# Altium project tester_board.PrjPCB (part 1 of 4)
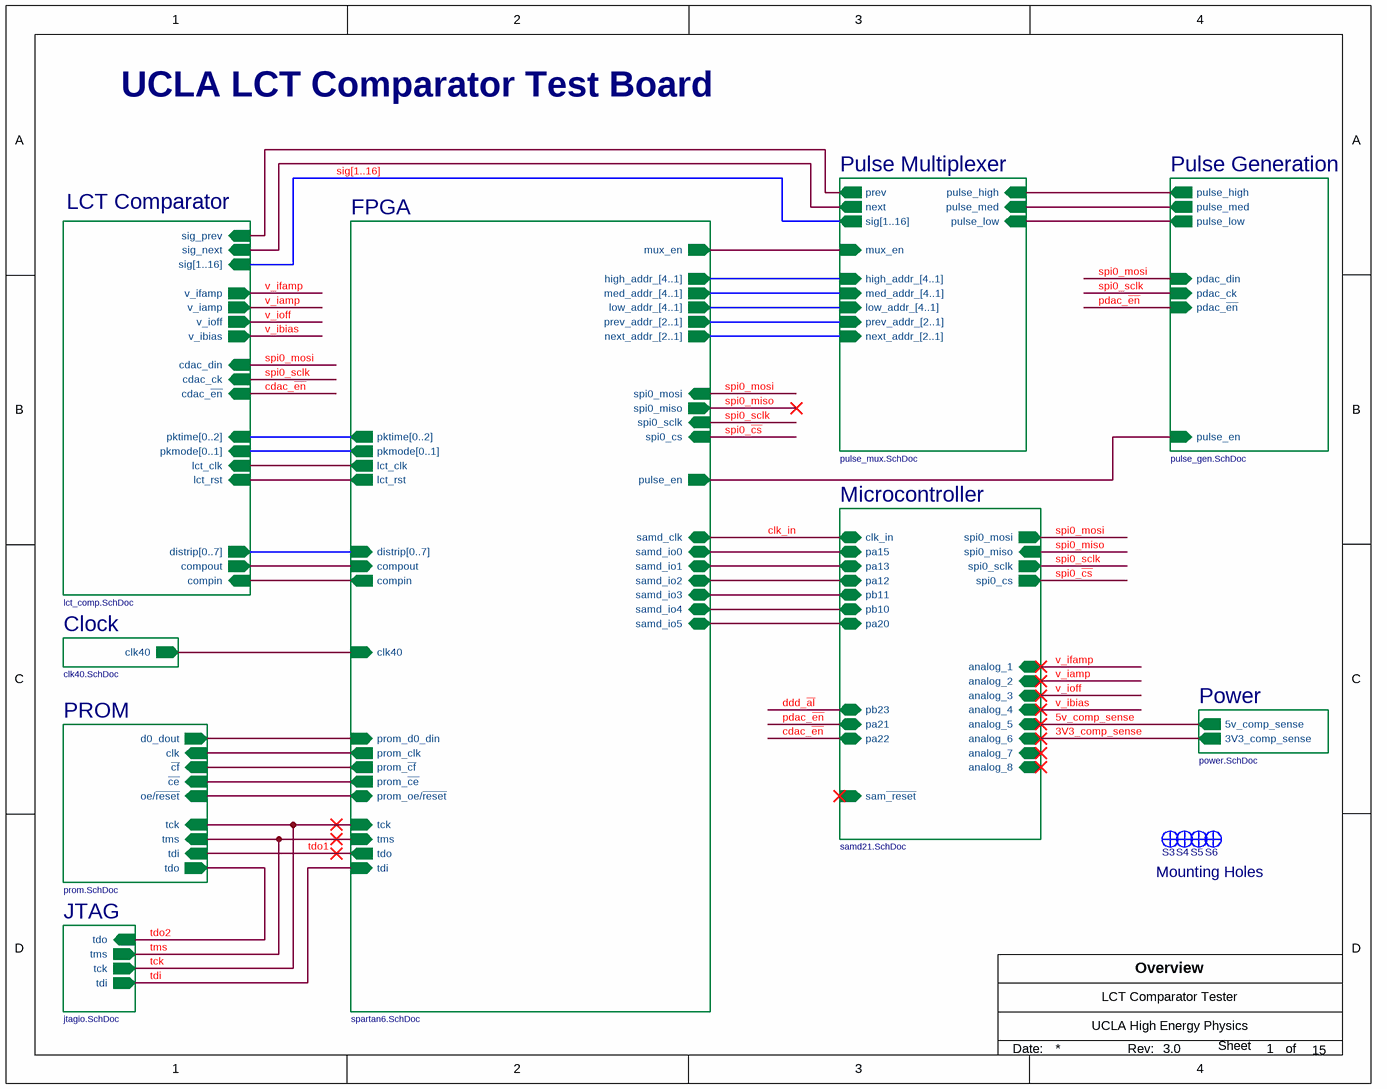
[diagram p0: tester_board.SchDoc]
15 sheets, 418 parts. Net scope: hierarchical (ports join the sheet entries above them; power ports are global).
Board file: tester_board.PcbDoc
Sheets:
  tester_board.SchDoc
    LCT Comparator = lct_comp.SchDoc
    Power = power.SchDoc
      Charge Pump = charge_pump.SchDoc
    FPGA = spartan6.SchDoc
      FPGA Configuration = fpga_configuration.SchDoc
      FPGA Power = fpga_power.SchDoc
    PROM = prom.SchDoc
    JTAG = jtagio.SchDoc
    Pulse Generation = pulse_gen.SchDoc
      RC 1-4 = integrator_4pole.SchDoc
      RC 4-6 = integrator_inverter.SchDoc
    Clock = clk40.SchDoc
    Pulse Multiplexer = pulse_mux.SchDoc
    Microcontroller = samd21.SchDoc

## Sheet tester_board.SchDoc: Overview
size A; Engineer: A. Peck; Organization: UCLA High Energy Physics; DocumentNumber: 1; Revision: 3.0; SheetNumber: 1; SheetTotal: 15; Project: LCT Comparator Tester

### Parts
S3  STANDOFF #4  [STANDOFF #4]  (value not drawn)  (no BOM)
S4  STANDOFF #4  [STANDOFF #4]  (value not drawn)  (no BOM)
S5  STANDOFF #4  [STANDOFF #4]  (value not drawn)  (no BOM)
S6  STANDOFF #4  [STANDOFF #4]  (value not drawn)  (no BOM)

### Sub-sheets
Clock = clk40.SchDoc: clk40 (out)
FPGA = spartan6.SchDoc: pkmode[0..1] (out), distrip[0..7] (in), pktime[0..2] (out), lct_clk (out), lct_rst (out), compin (out), compout (in), tck (in), tdi (in), tdo (out), tms (in), prom_d0_din (in), prom_~{ce} (out), prom_~{cf} (out), prom_clk (out), prom_oe/~{reset} (bidir), clk40 (in), mux_en (out), high_addr_[4..1] (out), med_addr_[4..1] (out), low_addr_[4..1] (out), prev_addr_[2..1] (out), next_addr_[2..1] (out), spi0_miso (out), spi0_mosi (in), spi0_sclk (in), spi0_cs (in), pulse_en (out), samd_clk (bidir), samd_io1 (bidir), samd_io2 (bidir), samd_io3 (bidir), samd_io4 (bidir), samd_io0 (bidir), samd_io5 (bidir)
JTAG = jtagio.SchDoc: tck (out), tms (out), tdi (out), tdo (in)
LCT Comparator = lct_comp.SchDoc: sig[1..16] (in), pkmode[0..1] (in), distrip[0..7] (out), pktime[0..2] (in), lct_clk (in), lct_rst (in), compin (in), sig_prev (in), sig_next (in), v_ifamp (out), v_iamp (out), v_ioff (out), v_ibias (out), cdac_~{en} (in), cdac_din (in), cdac_ck (in), compout (out)
Microcontroller = samd21.SchDoc: pa15 (bidir), clk_in (bidir), pa13 (bidir), pa12 (bidir), pb11 (bidir), pb10 (bidir), pa20 (bidir), pb23 (bidir), analog_1 (bidir), analog_2 (bidir), analog_3 (bidir), analog_4 (bidir), analog_5 (bidir), analog_6 (bidir), analog_7 (bidir), analog_8 (bidir), spi0_miso (in), spi0_mosi (out), spi0_sclk (out), spi0_cs (out), sam~{_reset} (in), pa21 (bidir), pa22 (bidir)
Power = power.SchDoc: 3V3_comp_sense (out), 5v_comp_sense (out)
PROM = prom.SchDoc: d0_dout (out), tck (in), tdi (in), tdo (out), tms (in), clk (in), ~{ce} (in), oe/~{reset} (in), ~{cf} (in)
Pulse Generation = pulse_gen.SchDoc: pulse_en (in), pdac_~{en} (in), pdac_din (in), pdac_ck (in), pulse_high (out), pulse_med (out), pulse_low (out)
Pulse Multiplexer = pulse_mux.SchDoc: sig[1..16] (out), high_addr_[4..1] (in), med_addr_[4..1] (in), low_addr_[4..1] (in), prev (out), pulse_high (in), pulse_med (in), pulse_low (in), next (out), prev_addr_[2..1] (in), next_addr_[2..1] (in), mux_en (in)

### Nets
3V3_comp_sense: sheet Power/3V3_comp_sense, sheet Microcontroller/analog_6
5v_comp_sense: sheet Power/5v_comp_sense, sheet Microcontroller/analog_5
cdac_~{en}: sheet LCT Comparator/cdac_~{en}, sheet Microcontroller/pa22
clk_in: sheet FPGA/samd_clk, sheet Microcontroller/clk_in
clk_prom: sheet FPGA/prom_clk, sheet PROM/clk
compin: sheet LCT Comparator/compin, sheet FPGA/compin
compout: sheet LCT Comparator/compout, sheet FPGA/compout
lct_clk: sheet LCT Comparator/lct_clk, sheet FPGA/lct_clk
lct_rst: sheet LCT Comparator/lct_rst, sheet FPGA/lct_rst
mux_en: sheet FPGA/mux_en, sheet Pulse Multiplexer/mux_en
pdac_~{en}: sheet Pulse Generation/pdac_~{en}, sheet Microcontroller/pa21
prom_d0_din: sheet FPGA/prom_d0_din, sheet PROM/d0_dout
prom_oe/~{reset}: sheet FPGA/prom_oe/~{reset}, sheet PROM/oe/~{reset}
pulse_en: sheet FPGA/pulse_en, sheet Pulse Generation/pulse_en
pulse_high: sheet Pulse Generation/pulse_high, sheet Pulse Multiplexer/pulse_high
pulse_low: sheet Pulse Generation/pulse_low, sheet Pulse Multiplexer/pulse_low
pulse_med: sheet Pulse Generation/pulse_med, sheet Pulse Multiplexer/pulse_med
spi0_~{cs}: sheet FPGA/spi0_cs, sheet Microcontroller/spi0_cs
spi0_miso: sheet FPGA/spi0_miso, sheet Microcontroller/spi0_miso
spi0_mosi: sheet LCT Comparator/cdac_din, sheet FPGA/spi0_mosi, sheet Pulse Generation/pdac_din, sheet Microcontroller/spi0_mosi
spi0_sclk: sheet LCT Comparator/cdac_ck, sheet FPGA/spi0_sclk, sheet Pulse Generation/pdac_ck, sheet Microcontroller/spi0_sclk
tck: sheet FPGA/tck, sheet PROM/tck, sheet JTAG/tck
tdi: sheet FPGA/tdi, sheet JTAG/tdi
tdo1: sheet FPGA/tdo, sheet PROM/tdi
tdo2: sheet PROM/tdo, sheet JTAG/tdo
tms: sheet FPGA/tms, sheet PROM/tms, sheet JTAG/tms
v_iamp: sheet LCT Comparator/v_iamp, sheet Microcontroller/analog_2
v_ibias: sheet LCT Comparator/v_ibias, sheet Microcontroller/analog_4
v_ifamp: sheet LCT Comparator/v_ifamp, sheet Microcontroller/analog_1
v_ioff: sheet LCT Comparator/v_ioff, sheet Microcontroller/analog_3
NetC24_1: sheet LCT Comparator/sig_prev, sheet Pulse Multiplexer/prev
NetC48_1: sheet LCT Comparator/sig_next, sheet Pulse Multiplexer/next
NetQ5_1: sheet FPGA/prom_~{ce}, sheet PROM/~{ce}
NetR63_1: sheet FPGA/prom_~{cf}, sheet PROM/~{cf}
NetR102_2: sheet FPGA/clk40, sheet Clock/clk40
NetU17_38: sheet FPGA/samd_io5, sheet Microcontroller/pa20
NetU17_46: sheet FPGA/samd_io0, sheet Microcontroller/pa15
NetU17_48: sheet FPGA/samd_io1, sheet Microcontroller/pa13
NetU17_50: sheet FPGA/samd_io2, sheet Microcontroller/pa12
NetU17_55: sheet FPGA/samd_io3, sheet Microcontroller/pb11
NetU17_56: sheet FPGA/samd_io4, sheet Microcontroller/pb10

Not connected (* = marked no-connect by the designer): S3 1; S4 1; S5 1; S6 1

### Buses and harness runs
bus sheet FPGA/distrip[0..7] = sheet LCT Comparator/distrip[0..7]
bus sheet FPGA/high_addr_[4..1] = sheet Pulse Multiplexer/high_addr_[4..1]
bus sheet FPGA/low_addr_[4..1] = sheet Pulse Multiplexer/low_addr_[4..1]
bus sheet FPGA/med_addr_[4..1] = sheet Pulse Multiplexer/med_addr_[4..1]
bus sheet FPGA/next_addr_[2..1] = sheet Pulse Multiplexer/next_addr_[2..1]
bus sheet FPGA/pkmode[0..1] = sheet LCT Comparator/pkmode[0..1]
bus sheet FPGA/pktime[0..2] = sheet LCT Comparator/pktime[0..2]
bus sheet FPGA/prev_addr_[2..1] = sheet Pulse Multiplexer/prev_addr_[2..1]
bus sig[1..16] = sheet LCT Comparator/sig[1..16] = sheet Pulse Multiplexer/sig[1..16]

### Notes on the sheet
- UCLA LCT Comparator Test Board
- Mounting Holes
- Date:
- Rev:
- of
- Sheet

### Library data of the parts
S3-S6 = STANDOFF #4: Mounting Hole #4

## Sheet lct_comp.SchDoc: LCT Comparator
size B; Engineer: A. Peck; Organization: UCLA High Energy Physics; DocumentNumber: 2; Revision: 3.0; SheetNumber: 2; SheetTotal: 15; Project: LCT Comparator Tester
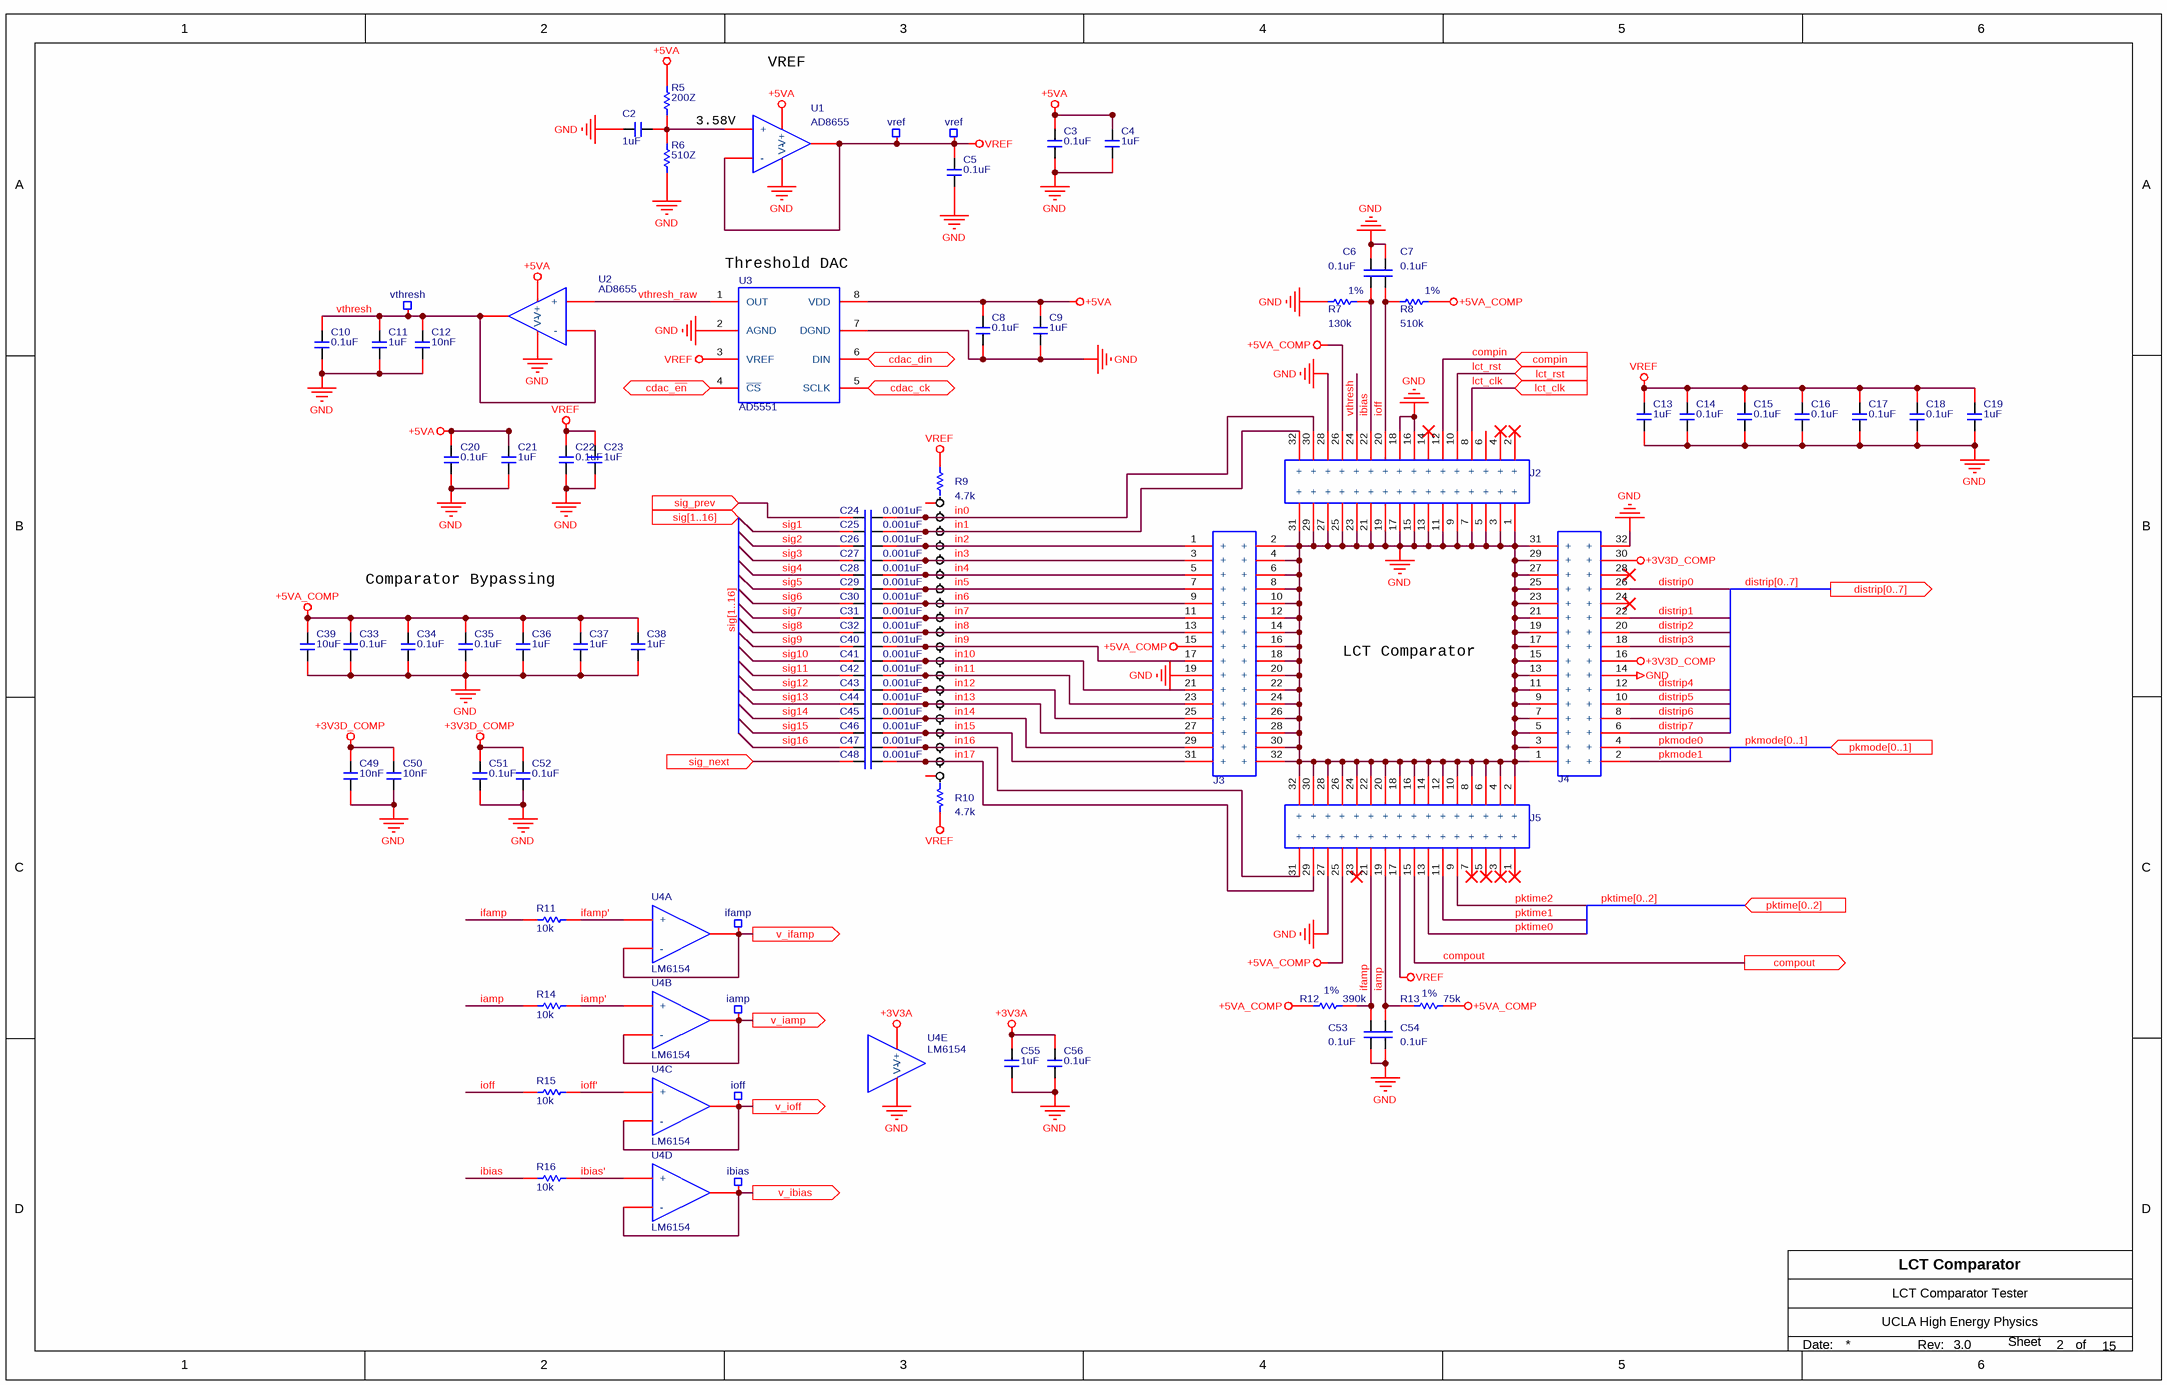
[diagram p1: lct_comp.SchDoc]

### Parts
C2  1uF  [C0603]
C3  0.1uF  [C0603]
C4  1uF  [C0603]
C5  0.1uF  [C0603]
C6  0.1uF  [C0603]
C7  0.1uF  [C0603]
C8  0.1uF  [C0603]
C9  1uF  [C0603]
C10  0.1uF  [C0603]
C11  1uF  [C0603]
C12  10nF  [C0603]
C13  1uF  [C0603]
C14  0.1uF  [C0603]
C15  0.1uF  [C0603]
C16  0.1uF  [C0603]
C17  0.1uF  [C0603]
C18  0.1uF  [C0603]
C19  1uF  [C0603]
C20  0.1uF  [C0603]
C21  1uF  [C0603]
C22  0.1uF  [C0603]
C23  1uF  [C0603]
C24  0.001uF  [C0603]
C25  0.001uF  [C0603]
C26  0.001uF  [C0603]
C27  0.001uF  [C0603]
C28  0.001uF  [C0603]
C29  0.001uF  [C0603]
C30  0.001uF  [C0603]
C31  0.001uF  [C0603]
C32  0.001uF  [C0603]
C33  0.1uF  [C0603]
C34  0.1uF  [C0603]
C35  0.1uF  [C0603]
C36  1uF  [C0603]
C37  1uF  [C0603]
C38  1uF  [C0603]
C39  10uF  [c1206]
C40  0.001uF  [C0603]
C41  0.001uF  [C0603]
C42  0.001uF  [C0603]
C43  0.001uF  [C0603]
C44  0.001uF  [C0603]
C45  0.001uF  [C0603]
C46  0.001uF  [C0603]
C47  0.001uF  [C0603]
C48  0.001uF  [C0603]
C49  10nF  [C0603]
C50  10nF  [C0603]
C51  0.1uF  [C0603]
C52  0.1uF  [C0603]
C53  0.1uF  [C0603]
C54  0.1uF  [C0603]
C55  1uF  [C0603]
C56  0.1uF  [C0603]
J2  HEADER 02x16 RCPT  [HEADER 02x16]  (value not drawn)
J3  HEADER 02x16 RCPT  [HEADER 02x16]  (value not drawn)
J4  HEADER 02x16 RCPT  [HEADER 02x16]  (value not drawn)
J5  HEADER 02x16 RCPT  [HEADER 02x16]  (value not drawn)
R5  200Z  [R0805]
R6  510Z  [R0805]
R7  130k  [R0603]
R8  510k  [R0603]
R9  4.7k  [SIP-11]
R10  4.7k  [SIP-11]
R11  10k  [R0603]
R12  390k  [R0603]
R13  75k  [R0603]
R14  10k  [R0603]
R15  10k  [R0603]
R16  10k  [R0603]
TP1  vref  [TP_MICRO]  (no BOM)
TP2  vref  [TP_MICRO]  (no BOM)
TP3  vthresh  [TP_MICRO]  (no BOM)
TP4  ifamp  [TP_MICRO]  (no BOM)
TP5  iamp  [TP_MICRO]  (no BOM)
TP6  ioff  [TP_MICRO]  (no BOM)
TP7  ibias  [TP_MICRO]  (no BOM)
U1  AD8655  [MSOP-8]
U2  AD8655  [MSOP-8]
U3  AD5551  [SOIC-8]
U4  LM6154  [SOIC-14]  (parts A,B,C,D,E of 5)

### Ports
cdac_ck (in), cdac_din (in), cdac_~{en} (in), compin (in), compout (out), distrip[0..7] (out), lct_clk (in), lct_rst (in), pkmode[0..1] (in), pktime[0..2] (in), sig[1..16] (in), sig_next (in), sig_prev (in), v_iamp (out), v_ibias (out), v_ifamp (out), v_ioff (out)

### Nets
+3V3A: C55.2 C56.2 U4.4(V+)
+3V3D_COMP: C49.2 C50.2 C51.2 C52.2 J4.16(+) J4.30(+)
+5VA: C3.1 C4.2 C8.1 C9.2 C20.1 C21.2 R5.1 U1.7(V+) U2.7(V+) U3.8(VDD)
+5VA_COMP: C33.2 C34.2 C35.2 C36.2 C37.2 C38.2 C39.1 J2.26(+) J3.15(+) J5.25(+) R8.2 R12.1 R13.2
GND: C2.2 C3.2 C4.1 C5.2 C6.2 C7.2 C8.2 C9.1 C10.1 C11.2 C12.1 C13.2 C14.1 C15.1 C16.1 C17.1 C18.1 C19.2 C20.2 C21.1 C22.2 C23.1 C33.1 C34.1 C35.1 C36.1 C37.1 C38.1 C39.2 C49.1 C50.1 C51.1 C52.1 C53.1 C54.1 C55.1 C56.1 J2.1(+) J2.3(+) J2.5(+) J2.7(+) J2.9(+) J2.11(+) J2.13(+) J2.15(+) J2.16(+) J2.17(+) J2.18(+) J2.19(+) J2.21(+) J2.23(+) J2.25(+) J2.27(+) J2.28(+) J2.29(+) J2.31(+) J3.2(+) J3.4(+) J3.6(+) J3.8(+) J3.10(+) J3.12(+) J3.14(+) J3.16(+) J3.18(+) J3.19(+) J3.20(+) J3.22(+) J3.24(+) J3.26(+) J3.28(+) J3.30(+) J3.32(+) J4.1(+) J4.3(+) J4.5(+) J4.7(+) J4.9(+) J4.11(+) J4.13(+) J4.14(+) J4.15(+) J4.17(+) J4.19(+) J4.21(+) J4.23(+) J4.25(+) J4.27(+) J4.29(+) J4.31(+) J4.32(+) J5.2(+) J5.4(+) J5.6(+) J5.8(+) J5.10(+) J5.12(+) J5.14(+) J5.16(+) J5.18(+) J5.20(+) J5.22(+) J5.24(+) J5.26(+) J5.27(+) J5.28(+) J5.30(+) J5.32(+) R6.1 R7.1 U1.4(V-) U2.4(V-) U3.2(AGND) U3.7(DGND) U4.11(V-)
VREF: C5.1 C13.1 C14.2 C15.2 C16.2 C17.2 C18.2 C19.1 C22.1 C23.2 J5.17(+) R9.1 R10.1 TP1.1 TP2.1 U1.2(-) U1.6(OUT) U3.3(VREF)
cdac_~{en}: U3.4(~{CS}) ; port cdac_~{en}
compin: J2.12(+) ; port compin
compout: J5.15(+) ; port compout
distrip0: J4.26(+)
distrip1: J4.22(+)
distrip2: J4.20(+)
distrip3: J4.18(+)
distrip4: J4.12(+)
distrip5: J4.10(+)
distrip6: J4.8(+)
distrip7: J4.6(+)
iamp: C54.2 J5.19(+) R13.1 R14.1
iamp': R14.2 U4.5(+)
ibias: C6.1 J2.22(+) R7.2 R16.1
ibias': R16.2 U4.12(+)
ifamp: C53.2 J5.21(+) R11.1 R12.2
ifamp': R11.2 U4.3(+)
in0: C24.2 J2.30(+) R10.3
in1: C25.2 J2.32(+) R10.4
in2: C26.2 J3.1(+) R10.5
in3: C27.2 J3.3(+) R10.6
in4: C28.2 J3.5(+) R10.7
in5: C29.2 J3.7(+) R10.8
in6: C30.2 J3.9(+) R10.9
in7: C31.2 J3.11(+) R10.10
in8: C32.2 J3.13(+) R10.11
in9: C40.2 J3.17(+) R9.11
in10: C41.2 J3.21(+) R9.10
in11: C42.2 J3.23(+) R9.9
in12: C43.2 J3.25(+) R9.8
in13: C44.2 J3.27(+) R9.7
in14: C45.2 J3.29(+) R9.6
in15: C46.2 J3.31(+) R9.5
in16: C47.2 J5.31(+) R9.4
in17: C48.2 J5.29(+) R9.3
ioff: C7.1 J2.20(+) R8.1 R15.1
ioff': R15.2 U4.10(+)
lct_clk: J2.8(+) ; port lct_clk
lct_rst: J2.10(+) ; port lct_rst
pkmode0: J4.4(+)
pkmode1: J4.2(+)
pktime0: J5.13(+)
pktime1: J5.11(+)
pktime2: J5.9(+)
sig1: C25.1 ; port sig[1..16]
sig2: C26.1
sig3: C27.1
sig4: C28.1
sig5: C29.1
sig6: C30.1
sig7: C31.1
sig8: C32.1
sig9: C40.1  [also labelled sig[1..16]]
sig10: C41.1
sig11: C42.1
sig12: C43.1
sig13: C44.1
sig14: C45.1
sig15: C46.1
sig16: C47.1
spi0_mosi: U3.6(DIN) ; port cdac_din
spi0_sclk: U3.5(SCLK) ; port cdac_ck
v_iamp: TP5.1 U4.6(-) U4.7(OUT) ; port v_iamp
v_ibias: TP7.1 U4.13(-) U4.14(OUT) ; port v_ibias
v_ifamp: TP4.1 U4.1(OUT) U4.2(-) ; port v_ifamp
v_ioff: TP6.1 U4.8(OUT) U4.9(-) ; port v_ioff
vthresh: C10.2 C11.1 C12.2 J2.24(+) TP3.1 U2.2(-) U2.6(OUT)
vthresh_raw: U2.3(+) U3.1(OUT)
NetC2_1: C2.1 R5.2 R6.2 U1.3(+)
NetC24_1: C24.1 ; port sig_prev
NetC48_1: C48.1 ; port sig_next

Not connected (* = marked no-connect by the designer): J2 2(+)* 4(+)* 6(+) 14(+)*; J4 24(+)* 28(+)*; J5 1(+)* 3(+)* 5(+)* 7(+)* 23(+)*; R9 2; R10 2; U1 5(NC) NC(8); U2 5(NC) NC(8)

### Buses and harness runs
bus distrip[0..7] = port distrip[0..7]
bus pkmode[0..1] = port pkmode[0..1]
bus pktime[0..2] = port pktime[0..2]

### Notes on the sheet
- VREF
- 3.58V
- (near U3) Threshold DAC
- (near R7) 1%
- (near R8) 1%
- Comparator Bypassing
- LCT Comparator
- (near R12) 1%
- (near R13) 1%
- Date:
- Rev:
- of
- Sheet

### Library data of the parts
C2 C4 C9 C11 C13 C19 C21 C23 C36-C38 C55 = Murata/GRM188R61E105KA12D: CAP-CER, 2, 1.0uF, 10%, 25V, 0603; Manufacturer: Murata Electronics North America; Capacitance: 1µF; Temperature Coefficient: X5R; Supplier 1: Digi-Key; Supplier Part Number 1: 490-3897-1-ND; Manufacturer Part Number: GRM188R61E105KA12D; RoHS: RoHS Compliant; Category: Capacitors; Stock 1: 1899119; Pricing 1: 1=0.1, 10=0.036, 50=0.0196, 100=0.0165, 250=0.01352, 500=0.01156, 1000=0.009 (USD); Packaging: Cut Tape (CT); Tolerance: ±10%; Voltage - Rated: 25V; Mounting Type: Surface Mount, MLCC; Operating Temperature: -55°C ~ 85°C; Applications: General Purpose; Ratings: -; Package / Case: 0603 (1608 Metric); Size / Dimension: 0.063" L x 0.031" W (1.60mm x 0.80mm); Height - Seated (Max): -; Thickness (Max): 0.035" (0.90mm); Lead Spacing: -; Features: -; Lead Style: -; ComponentLink1URL: http://www.murata.com/~/media/webrenewal/support/library/catalog/products/capacitor/mlcc/c02e.pdf; ComponentLink1Description: http://www.murata.com/~/media/webrenewal/support/library/catalog/products/capacitor/mlcc/c02e.pdf
C3 C5-C8 C10 C14-C18 C20 C22 C33-C35 C51-C54 C56 = CAP/06035C104KAT2A: CAP-CER, 2, 0.1uF, 10%, 50V, 0603, X7R; Manufacturer: AVX Corporation; Capacitance: 0.10µF; Supplier 1: Digi-Key; Manufacturer Part Number: 06035C104KAT2A; RoHS: RoHS Compliant; Category: Capacitors; Stock 1: 4412408; Pricing 1: 1=0.1, 10=0.036, 25=0.0264, 50=0.0198, 100=0.0162, 250=0.01352, 500=0.01156, 1000=0.00908 (USD); Packaging: Cut Tape (CT); Tolerance: ±10%; Voltage - Rated: 50V; Temperature Coefficient: X7R; Mounting Type: Surface Mount, MLCC; Operating Temperature: -55°C ~ 125°C; Applications: General Purpose; Ratings: -; Package / Case: 0603 (1608 Metric); Size / Dimension: 0.063" L x 0.032" W (1.60mm x 0.81mm); Height - Seated (Max): -; Thickness (Max): 0.035" (0.90mm); Lead Spacing: -; Features: -; Lead Style: -; ComponentLink1URL: http://datasheets.avx.com/X7RDielectric.pdf; ComponentLink1Description: http://datasheets.avx.com/X7RDielectric.pdf; Supplier Part Number 1: 478-5052-1-ND; Supplier 2: Newark; Supplier Part Number 2: 54K2412
C12 C49 C50 = CAP/GRM188R71H103KA01D: CAP-CER, 2, 0.01uF, 10%, 50V, X7R, 0603; Manufacturer: Murata Electronics North America; Capacitance: 10000pF; Supplier 1: Digi-Key; Supplier Part Number 1: 490-1512-1-ND; Manufacturer Part Number: GRM188R71H103KA01D; RoHS: RoHS Compliant; Category: Capacitors; Stock 1: 3035311; Pricing 1: 1=0.1, 10=0.019, 50=0.01, 100=0.0085, 250=0.00696, 500=0.00596, 1000=0.00465 (USD); Packaging: Cut Tape (CT); Tolerance: ±10%; Voltage - Rated: 50V; Temperature Coefficient: X7R; Mounting Type: Surface Mount, MLCC; Operating Temperature: -55°C ~ 125°C; Applications: General Purpose; Ratings: -; Package / Case: 0603 (1608 Metric); Size / Dimension: 0.063" L x 0.031" W (1.60mm x 0.80mm); Height - Seated (Max): -; Thickness (Max): 0.035" (0.90mm); Lead Spacing: -; Features: -; Lead Style: -; ComponentLink1URL: http://www.murata.com/~/media/webrenewal/support/library/catalog/products/capacitor/mlcc/c02e.pdf; ComponentLink1Description: http://www.murata.com/~/media/webrenewal/support/library/catalog/products/capacitor/mlcc/c02e.pdf; Supplier 2: Newark; Supplier Part Number 2: 38K1669
C24-C32 C40-C48 = CAP/GRM188R71H102KA01D: CAP-CER, 0, 1000pF, 10%, 50V, 0603; Manufacturer: Murata Electronics North America; Temperature Coefficient: X7R; Supplier 1: Digi-Key; Supplier Part Number 1: 490-1494-6-ND; Manufacturer Part Number: GRM188R71H102KA01D; RoHS: RoHS Compliant; Category: Capacitors; Stock 1: 1044569; Pricing 1: 1=0.1, 10=0.02, 50=0.0108, 100=0.0091, 250=0.00744, 500=0.00636, 1000=0.00495 (USD); Packaging: Digi-Reel®; Capacitance: 1000pF; Tolerance: ±10%; Voltage - Rated: 50V; Mounting Type: Surface Mount, MLCC; Operating Temperature: -55°C ~ 125°C; Applications: General Purpose; Ratings: -; Package / Case: 0603 (1608 Metric); Size / Dimension: 0.063" L x 0.031" W (1.60mm x 0.80mm); Height - Seated (Max): -; Thickness (Max): 0.035" (0.90mm); Lead Spacing: -; Features: -; Lead Style: -; ComponentLink1URL: http://www.murata.com/~/media/webrenewal/support/library/catalog/products/capacitor/mlcc/c02e.pdf; ComponentLink1Description: http://www.murata.com/~/media/webrenewal/support/library/catalog/products/capacitor/mlcc/c02e.pdf; Supplier 2: Newark; Supplier Part Number 2: 51B220
C39 = CAP/GMK316F106ZL-T: CAP-CER, 2, 10uF, 10%, 35V, 1206; Manufacturer: Taiyo Yuden; Capacitance: 10µF; Tolerance: -20%, +80%; Temperature Coefficient: Y5V (F); Supplier 1: Digi-Key; Manufacturer Part Number: GMK316F106ZL-T; RoHS: RoHS Compliant; Category: Capacitors; Packaging: Cut Tape (CT); Voltage - Rated: 35V; Mounting Type: Surface Mount, MLCC; Operating Temperature: -30°C ~ 85°C; Package / Case: 1206 (3216 Metric); Size / Dimension: 0.126" L x 0.063" W (3.20mm x 1.60mm); Height - Seated (Max): -; Lead Spacing: -; Features: -; ComponentLink1URL: http://ds.yuden.co.jp/TYCOMPAS/ut/detail.do?productNo=GMK316F106ZL-T&fileName=GMK316F106ZL-T_SS&mode=specSheetDownload; ComponentLink1Description: http://ds.yuden.co.jp/TYCOMPAS/ut/detail.do?productNo=GMK316F106ZL-T&fileName=GMK316F106ZL-T_SS&mode=specSheetDownload; Supplier Part Number 1: 587-1352-1-ND; Stock 1: 249989; Pricing 1: 1=0.46, 10=0.345, 50=0.2012, 100=0.161, 250=0.115, 500=0.0782, 1000=0.06325 (USD); Applications: General Purpose; Ratings: -; Thickness (Max): 0.071" (1.80mm); Lead Style: -
J2-J5 = HEADER 02x16 RCPT: Header, 02x16, 100 mil, PTH; Manufacturer: TE Connectivity AMP Connectors; Manufacturer Part Number: 6-534206-6; Connector Type: Receptacle; Number of Positions: 32; Number of Positions Loaded: All; Pitch: 0.100" (2.54mm); Supplier 1: Digi-Key; RoHS: RoHS Compliant; Category: Connectors, Interconnects; Stock 1: 447; Pricing 1: 1=4.43, 10=4.255, 50=3.7234, 100=3.546, 250=3.10276, 500=3.0141, 1000=2.57085, 2500=2.561 (USD); Packaging: Tube; Part Status: Active; Contact Type: Female Socket; Number of Rows: 2; Row Spacing: 0.100" (2.54mm); Mounting Type: Through Hole; Termination: Solder; Fastening Type: -; Features: -; Contact Finish: Gold; Contact Finish Thickness: 30µin (0.76µm); Color: Black; ComponentLink1URL: http://www.te.com/commerce/DocumentDelivery/DDEController?Action=srchrtrv&DocNm=534206&DocType=Customer+Drawing&DocLang=English; ComponentLink1Description: http://www.te.com/commerce/DocumentDelivery/DDEController?Action=srchrtrv&DocNm=534206&DocType=Customer+Drawing&DocLang=English; Supplier Part Number 1: A32946-ND
R5 = CRCW0805200RFKEA: RES0, SMD,  200Z, 1.0%, 1/10W, 0805; Manufacturer: Vishay Dale; Resistance (Ohms): 200; Tolerance: ±1%; Power (Watts): 0.125W, 1/8W; Temperature Coefficient: ±100ppm/°C; Supplier 1: Digi-Key; Manufacturer Part Number: CRCW0805200RFKEA; RoHS: RoHS Compliant; Category: Resistors; Stock 1: 204736; Pricing 1: 1=0.1, 10=0.04, 25=0.0288, 50=0.022, 100=0.0162, 250=0.01236, 500=0.0099, 1000=0.00729, 2500=0.00632 (USD); Packaging: Cut Tape (CT); Part Status: Active; Composition: Thick Film; Features: Automotive AEC-Q200; Operating Temperature: -55°C ~ 155°C; Package / Case: 0805 (2012 Metric); Supplier Device Package: 0805; Size / Dimension: 0.079" L x 0.049" W (2.00mm x 1.25mm); Height - Seated (Max): 0.020" (0.50mm); Number of Terminations: 2; Failure Rate: -; ComponentLink1URL: http://www.vishay.com/docs/20035/dcrcwe3.pdf; ComponentLink1Description: http://www.vishay.com/docs/20035/dcrcwe3.pdf; Supplier Part Number 1: 541-200CCT-ND
R6 = CRCW0805510RFKEA: RES0, SMD,  510Z, 1.0%, 1/10W, 0805; Manufacturer: Vishay Dale; Resistance (Ohms): 510; Tolerance: ±1%; Power (Watts): 0.125W, 1/8W; Temperature Coefficient: ±100ppm/°C; Supplier 1: Digi-Key; Manufacturer Part Number: CRCW0805510RFKEA; RoHS: RoHS Compliant; Category: Resistors; Stock 1: 33353; Pricing 1: 1=0.1, 10=0.04, 25=0.0288, 50=0.022, 100=0.0162, 250=0.01236, 500=0.0099, 1000=0.00729, 2500=0.00632 (USD); Packaging: Cut Tape (CT); Part Status: Active; Composition: Thick Film; Features: Automotive AEC-Q200; Operating Temperature: -55°C ~ 155°C; Package / Case: 0805 (2012 Metric); Supplier Device Package: 0805; Size / Dimension: 0.079" L x 0.049" W (2.00mm x 1.25mm); Height - Seated (Max): 0.020" (0.50mm); Number of Terminations: 2; Failure Rate: -; ComponentLink1URL: http://www.vishay.com/docs/20035/dcrcwe3.pdf; ComponentLink1Description: http://www.vishay.com/docs/20035/dcrcwe3.pdf; Supplier Part Number 1: 541-510CCT-ND
R7 = CRCW0603130KFKEA: RES1, SMD,  130k, 1.0%, 1/10W, 0603; Manufacturer: Vishay Dale; Tolerance: ±1%; Power (Watts): 0.1W, 1/10W; Temperature Coefficient: ±100ppm/°C; Supplier 1: Digi-Key; Manufacturer Part Number: CRCW0603130KFKEA; RoHS: RoHS Compliant; Category: Resistors; Stock 1: 32167; Pricing 1: 1=0.1, 10=0.03, 25=0.022, 50=0.0168, 100=0.0123, 250=0.0094, 500=0.00752, 1000=0.00554, 2500=0.00481 (USD); Packaging: Cut Tape (CT); Part Status: Active; Resistance (Ohms): 130k; Composition: Thick Film; Features: Automotive AEC-Q200; Operating Temperature: -55°C ~ 155°C; Package / Case: 0603 (1608 Metric); Supplier Device Package: 0603; Size / Dimension: 0.063" L x 0.033" W (1.60mm x 0.85mm); Height - Seated (Max): 0.020" (0.50mm); Number of Terminations: 2; Failure Rate: -; ComponentLink1URL: http://www.vishay.com/docs/20035/dcrcwe3.pdf; ComponentLink1Description: http://www.vishay.com/docs/20035/dcrcwe3.pdf; Supplier Part Number 1: 541-130KHCT-ND
R8 = RES/RC0603JR-07510KL: RES1, SMD,  510k, 1.0%, 1/10W, 0603; Manufacturer: Yageo; Tolerance: ±5%; Power (Watts): 0.1W, 1/10W; Temperature Coefficient: ±100ppm/°C; Supplier 1: Digi-Key; Manufacturer Part Number: RC0603JR-07510KL; RoHS: RoHS Compliant; Category: Resistors; Stock 1: 110895; Pricing 1: 1=0.1, 10=0.011, 25=0.008, 100=0.0044, 250=0.00336, 500=0.0027, 1000=0.00198, 2500=0.00172 (USD); Packaging: Cut Tape (CT); Resistance (Ohms): 510k; Composition: Thick Film; Features: Moisture Resistant; Operating Temperature: -55°C ~ 155°C; Package / Case: 0603 (1608 Metric); Supplier Device Package: 0603; Size / Dimension: 0.063" L x 0.031" W (1.60mm x 0.80mm); Height: 0.022" (0.55mm); Number of Terminations: 2; ComponentLink1URL: http://www.yageo.com/documents/recent/PYu-RC_Group_51_RoHS_L_04.pdf; ComponentLink1Description: http://www.yageo.com/documents/recent/PYu-RC_Group_51_RoHS_L_04.pdf; Supplier Part Number 1: 311-510KGRCT-ND
R9 R10 = R4K7_SIP10: 4611X-101-472LF; Manufacturer: Bourns Inc.; Circuit Type: Bussed; Tolerance: ±2%; Number of Resistors: 10; Power Per Element: 200mW; Temperature Coefficient: ±100ppm/°C; Manufacturer Part Number: 4611X-101-472LF; RoHS: RoHS Compliant; Category: Resistors; Packaging: Bulk; Resistance (Ohms): 4.7k; Number of Pins: 11; Operating Temperature: -55°C ~ 125°C; Applications: -; Mounting Type: Through Hole; Package / Case: 11-SIP; Supplier Device Package: 11-SIP; Size / Dimension: 1.098" L x 0.098" W (27.89mm x 2.49mm); Height: 0.200" (5.08mm); ComponentLink1URL: http://www.bourns.com/data/global/pdfs/4600x.pdf; ComponentLink1Description: http://www.bourns.com/data/global/pdfs/4600x.pdf; Supplier 1: Digi-Key; Stock 1: 279; Pricing 1: 1=0.45, 10=0.416, 25=0.3752, 50=0.3626, 100=0.35, 250=0.325, 500=0.3, 1000=0.28125, 2500=0.2375 (USD); Supplier Part Number 1: 4611X-101-472LF-ND
R11 R14-R16 = CRCW060310K0FKEA: RES1, SMD, 10.0k, 1.0%, 1/10W, 0603; Manufacturer: Vishay Dale; Tolerance: ±1%; Power (Watts): 0.1W, 1/10W; Temperature Coefficient: ±100ppm/°C; Supplier 1: Digi-Key; Manufacturer Part Number: CRCW060310K0FKEA; RoHS: RoHS Compliant; Category: Resistors; Stock 1: 1592879; Pricing 1: 1=0.1, 10=0.03, 25=0.022, 50=0.0168, 100=0.0123, 250=0.0094, 500=0.00752, 1000=0.00554, 2500=0.00481 (USD); Packaging: Cut Tape (CT); Resistance (Ohms): 10k; Composition: Thick Film; Features: Automotive AEC-Q200; Operating Temperature: -55°C ~ 155°C; Package / Case: 0603 (1608 Metric); Supplier Device Package: 0603; Size / Dimension: 0.061" L x 0.033" W (1.55mm x 0.85mm); Height: 0.020" (0.50mm); Number of Terminations: 2; ComponentLink1URL: http://www.vishay.com/docs/20035/dcrcwe3.pdf; ComponentLink1Description: http://www.vishay.com/docs/20035/dcrcwe3.pdf; Supplier Part Number 1: 541-10.0KHCT-ND
R12 = CRCW0603390KFKEA: RES1, SMD,  390k, 1.0%, 1/10W, 0603; Manufacturer: Vishay Dale; Tolerance: ±1%; Power (Watts): 0.1W, 1/10W; Temperature Coefficient: ±100ppm/°C; Supplier 1: Digi-Key; Manufacturer Part Number: CRCW0603390KFKEA; RoHS: RoHS Compliant; Category: Resistors; Stock 1: 37100; Pricing 1: 1=0.1, 10=0.03, 25=0.022, 50=0.0168, 100=0.0123, 250=0.0094, 500=0.00752, 1000=0.00554, 2500=0.00481 (USD); Packaging: Cut Tape (CT); Part Status: Active; Resistance (Ohms): 390k; Composition: Thick Film; Features: Automotive AEC-Q200; Operating Temperature: -55°C ~ 155°C; Package / Case: 0603 (1608 Metric); Supplier Device Package: 0603; Size / Dimension: 0.063" L x 0.033" W (1.60mm x 0.85mm); Height - Seated (Max): 0.020" (0.50mm); Number of Terminations: 2; Failure Rate: -; ComponentLink1URL: http://www.vishay.com/docs/20035/dcrcwe3.pdf; ComponentLink1Description: http://www.vishay.com/docs/20035/dcrcwe3.pdf; Supplier Part Number 1: 541-390KHCT-ND
R13 = CRCW060375K0FKEA: RES1, SMD, 75.0k, 1.0%, 1/10W, 0603; Manufacturer: Samsung Electro-Mechanics America, Inc; Manufacturer Part Number: RC1608F4751CS; Resistance (Ohms): 4.75k; Tolerance: ±1%; Power (Watts): 0.1W, 1/10W; Temperature Coefficient: ±100ppm/°C; Supplier 1: Digi-Key; RoHS: RoHS Compliant; Category: Resistors; Stock 1: 15535; Pricing 1: 1=0.1, 10=0.011, 25=0.0084, 100=0.0047, 500=0.00286, 1000=0.0021, 2500=0.00182 (USD); Packaging: Cut Tape (CT); Composition: Thick Film; Features: -; Operating Temperature: -55°C ~ 155°C; Package / Case: 0603 (1608 Metric); Supplier Device Package: 0603 (1608 Metric); Size / Dimension: 0.063" L x 0.031" W (1.60mm x 0.80mm); Height: 0.022" (0.55mm); Number of Terminations: 2; ComponentLink1URL: http://www.samsungsem.com/global/support/library/product-catalog/__icsFiles/afieldfile/2015/01/12/CHIP_RESISTOR_150112_1.pdf; ComponentLink1Description: http://www.samsungsem.com/global/support/library/product-catalog/__icsFiles/afieldfile/2015/01/12/CHIP_RESISTOR_150112_1.pdf; Supplier Part Number 1: 1276-4710-1-ND
TP1-TP7 = TP_MICRO: Test Point, Round, Small
U1 U2 = AD/AD8655 MSOP-8: OPA, 28MHz, 11V/ us; Manufacturer: ANALOG DEVICES; Manufacturer Part Number: AD8655ARMZ; Amplifier Type: General Purpose; Number of Circuits: 1; Output Type: Rail-to-Rail; Slew Rate: 11 V/µs; Current - Input Bias: 1pA; Voltage - Input Offset: 50µV; Current - Supply: 3.7mA; Current - Output / Channel: 220mA; Voltage - Supply, Single/Dual (±): 2.7 V ~ 5.5 V; RoHS: YES; ComponentLink1URL: http://www.farnell.com/cad/1659554.zip; ComponentLink1Description: http://www.farnell.com/cad/1659554.zip; ComponentLink2URL: http://www.farnell.com/simulation/1738389.zip; ComponentLink2Description: http://www.farnell.com/simulation/1738389.zip; ComponentLink3URL: http://www.farnell.com/datasheets/1790136.pdf; ComponentLink3Description: http://www.farnell.com/datasheets/1790136.pdf; Category: Integrated Circuits (ICs); Packaging: Cut Tape (CT); Gain Bandwidth Product: 28MHz; -3db Bandwidth: -; Operating Temperature: -40°C ~ 125°C; Mounting Type: Surface Mount; Package / Case: 8-SOIC (0.154", 3.90mm Width); Supplier Device Package: 8-SOIC; ComponentLink4URL: http://www.analog.com/static/imported-files/data_sheets/AD8655_8656.pdf; ComponentLink4Description: http://www.analog.com/static/imported-files/data_sheets/AD8655_8656.pdf; Supplier 1: Digi-Key; Stock 1: 7774; Pricing 1: 1=2.28, 10=2.05, 100=1.6441, 500=1.35136, 1000=1.11862 (USD); Part Status: Active; ComponentLink5URL: http://www.analog.com/media/en/technical-documentation/data-sheets/AD8655_8656.pdf; ComponentLink5Description: http://www.analog.com/media/en/technical-documentation/data-sheets/AD8655_8656.pdf; Supplier Part Number 1: AD8655ARMZ-REELCT-ND
U3 = AD/AD5551 SOIC-8: DAC, 14-BIT, 1MSPS; Manufacturer: Analog Devices Inc.; Manufacturer Part Number: AD5551BRZ; Number of Bits: 14; Number of D/A Converters: 1; Settling Time: 1µs (Typ); Output Type: Voltage - Unbuffered; Differential Output: No; Data Interface: SPI; Reference Type: External; Voltage - Supply, Analog: 2.7 V ~ 5.5 V; INL/DNL (LSB): ±0.15, ±0.15; Architecture: R-2R; Supplier 1: Digi-Key; RoHS: RoHS Compliant; Category: Integrated Circuits (ICs); Packaging: Tube; Part Status: Active; Voltage - Supply, Digital: 2.7 V ~ 5.5 V; Operating Temperature: -40°C ~ 85°C; Package / Case: 8-SOIC (0.154", 3.90mm Width); Supplier Device Package: 8-SOIC; ComponentLink1URL: http://www.analog.com/media/en/technical-documentation/data-sheets/AD5551_5552.pdf; ComponentLink1Description: http://www.analog.com/media/en/technical-documentation/data-sheets/AD5551_5552.pdf; Stock 1: 625; Pricing 1: 1=16.85, 10=15.487, 100=13.0795, 500=11.63516, 1000=10.67225, 2500=10.27104, 5000=9.95007 (USD); Supplier Part Number 1: AD5551BRZ-ND
U4 = TI/LM6154 SOIC-14: OPA, 75MHz, Quad, RRIO; Manufacturer: Texas Instruments; Manufacturer Part Number: LM6154BCM/NOPB; Amplifier Type: General Purpose; Number of Circuits: 4; Output Type: Rail-to-Rail; Slew Rate: 30 V/µs; Gain Bandwidth Product: 80MHz; Current - Input Bias: 500nA; Voltage - Input Offset: 300µV; Current - Supply: 1.6mA; Current - Output / Channel: 16.9mA; Voltage - Supply, Single/Dual (±): 2.7 V ~ 24 V, ±1.35 V ~ 12 V; Supplier 1: Digi-Key; RoHS: RoHS Compliant; Category: Integrated Circuits (ICs); Stock 1: 869; Pricing 1: 1=7.18, 10=6.458, 50=5.8836, 100=5.3095, 250=4.879, 500=4.4485, 750=4.10411, 1000=3.8745 (USD); Packaging: Tube; -3db Bandwidth: -; Operating Temperature: 0°C ~ 70°C; Mounting Type: Surface Mount; Package / Case: 14-SOIC (0.154", 3.90mm Width); Supplier Device Package: 14-SOICN; ComponentLink1URL: http://www.ti.com/lit/ds/symlink/lm6152.pdf; ComponentLink1Description: http://www.ti.com/lit/ds/symlink/lm6152.pdf; Supplier Part Number 1: LM6154BCM/NOPB-ND

## Sheet power.SchDoc: Power
size A; Engineer: A. Peck; Organization: UCLA High Energy Physics; DocumentNumber: 14; Revision: 3.0; SheetNumber: 14; SheetTotal: 15; Project: LCT Comparator Tester
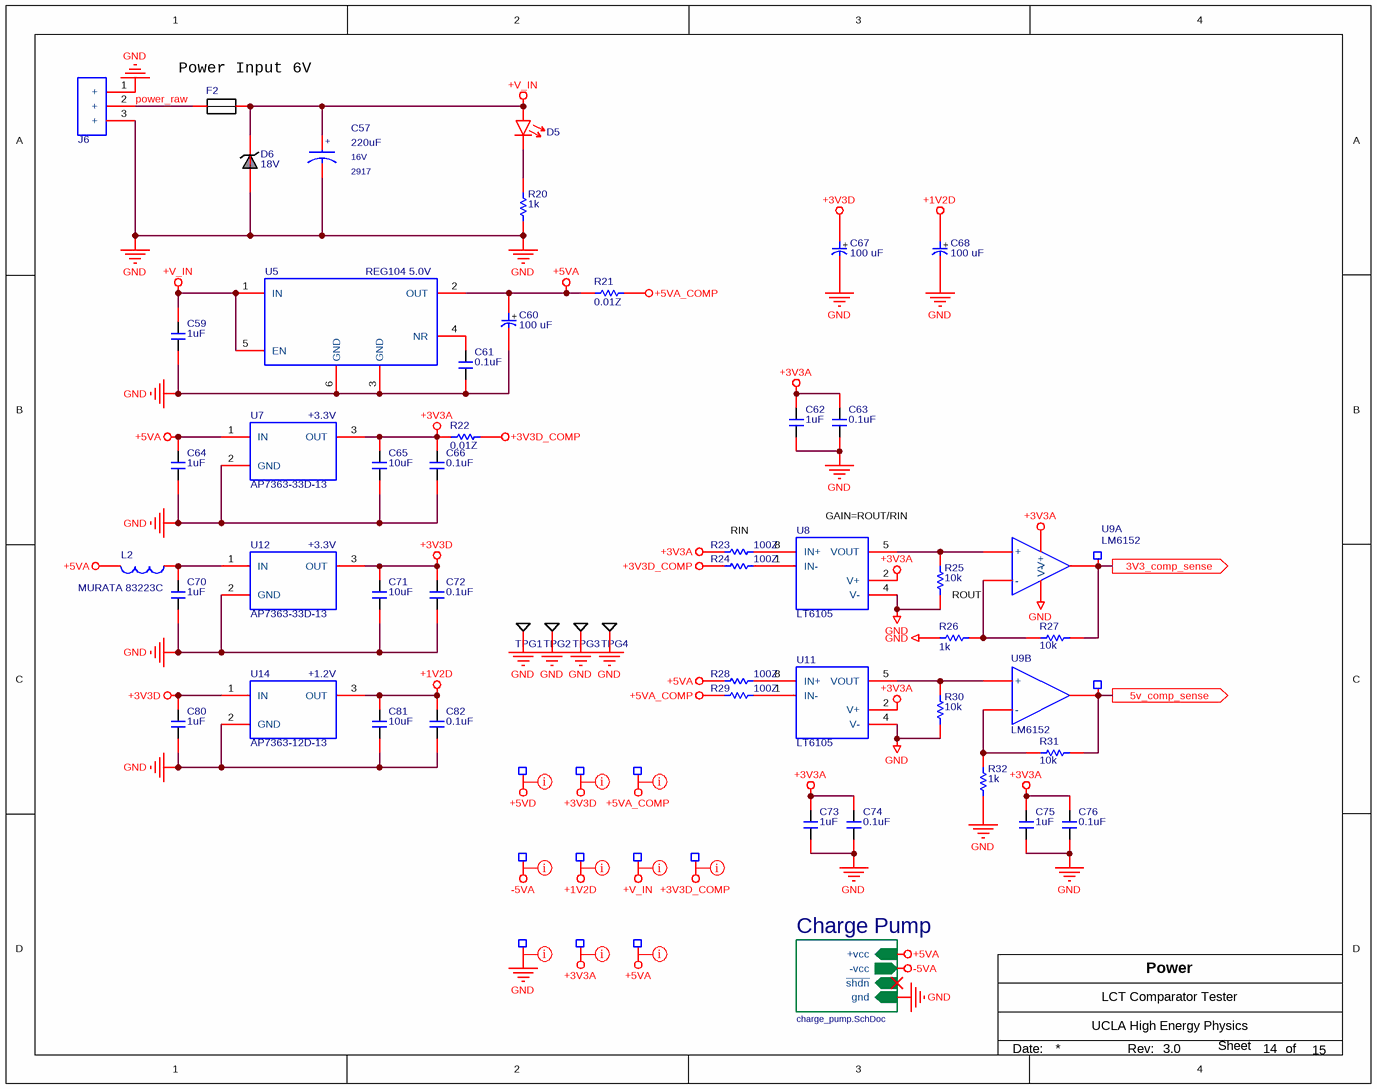
[diagram p2: power.SchDoc]

### Parts
C57  220uF  Voltage - Rated: 16V  package: 2917  [C2917_POLAR]
C59  1uF  [C0603]
C60  100 uF  [C2917_POLAR]
C61  0.1uF  [C0603]
C62  1uF  [C0603]
C63  0.1uF  [C0603]
C64  1uF  [C0603]
C65  10uF  [c1206]
C66  0.1uF  [C0603]
C67  100 uF  [C2917_POLAR]
C68  100 uF  [C2917_POLAR]
C70  1uF  [C0603]
C71  10uF  [c1206]
C72  0.1uF  [C0603]
C73  1uF  [C0603]
C74  0.1uF  [C0603]
C75  1uF  [C0603]
C76  0.1uF  [C0603]
C80  1uF  [C0603]
C81  10uF  [c1206]
C82  0.1uF  [C0603]
D5  LITEON/LTST-C171KRKT  [LED0805]  (value not drawn)
D6  18V  [DIODE SMB]
F2  Littelfuse/1206L  [R1206]  (value not drawn)
J6  TE/640456-3  [CON 3X1]  (value not drawn)
L2  MURATA 83223C  [MURATA-8300]
R20  1k  [R0603]
R21  0.01Z  [R1206]
R22  0.01Z  [R1206]
R23  100Z  [R0603]
R24  100Z  [R0603]
R25  10k  [R0603]
R26  1k  [R0603]
R27  10k  [R0603]
R28  100Z  [R0603]
R29  100Z  [R0603]
R30  10k  [R0603]
R31  10k  [R0603]
R32  1k  [R0603]
TP9  i3v3  [TP_MICRO]  (value not drawn)  (no BOM)
TP10  i5v0  [TP_MICRO]  (value not drawn)  (no BOM)
TP11  +5VD  [TP_MICRO]  (value not drawn)  (no BOM)
TP12  +3.3VD  [TP_MICRO]  (value not drawn)  (no BOM)
TP13  +5V COMP  [TP_MICRO]  (value not drawn)  (no BOM)
TP15  -5V  [TP_MICRO]  (value not drawn)  (no BOM)
TP16  +1.2V  [TP_MICRO]  (value not drawn)  (no BOM)
TP17  Power  [TP_MICRO]  (value not drawn)  (no BOM)
TP18  +3.3V COMP  [TP_MICRO]  (value not drawn)  (no BOM)
TP19  +3.3VA  [TP_MICRO]  (value not drawn)  (no BOM)
TP20  +5VA  [TP_MICRO]  (value not drawn)  (no BOM)
TP21  GND  [TP_MICRO]  (value not drawn)  (no BOM)
TPG1  TPG  [TPG]  (value not drawn)  (no BOM)
TPG2  TPG  [TPG]  (value not drawn)  (no BOM)
TPG3  TPG  [TPG]  (value not drawn)  (no BOM)
TPG4  TPG  [TPG]  (value not drawn)  (no BOM)
U5  REG104 5.0V  [SOT223-6]
U7  AP7363-33D-13  [TO252-2(3)]
U8  LT6105  [MSOP-8]
U9  LM6152  [SOIC-8]  (parts A,B of 2)
U11  LT6105  [MSOP-8]
U12  AP7363-33D-13  [TO252-2(3)]
U14  AP7363-12D-13  [TO252-2(3)]

### Sub-sheets
Charge Pump = charge_pump.SchDoc: ~{shdn} (in), gnd (in), -vcc (out), +vcc (in)

### Ports
3V3_comp_sense (out), 5v_comp_sense (out)

### Nets
+1V2D: C68.1(+) C81.2 C82.1 TP16.1 U14.3(OUT)
+3V3A: C62.2 C63.2 C65.2 C66.1 C73.2 C74.2 C75.2 C76.2 R22.1 R23.1 TP19.1 U7.3(OUT) U8.2(V+) U9.8(V+) U11.2(V+)
+3V3D: C67.1(+) C71.2 C72.1 C80.1 TP12.1 U12.3(OUT) U14.1(IN)
+3V3D_COMP: R22.2 R24.1 TP18.1
+5VA: C60.1(+) C64.1 L2.1 R21.1 R28.1 TP20.1 U5.2(OUT) U7.1(IN) ; sheet Charge Pump/+vcc
+5VA_COMP: R21.2 R29.1 TP13.1
+5VD: TP11.1
+V_IN: C57.1 C59.1 D5.A D6.K F2.2 TP17.1 U5.1(IN) U5.5(EN)
-5VA: TP15.1 ; sheet Charge Pump/-vcc
GND: C57.2 C59.2 C60.2(-) C61.2 C62.1 C63.1 C64.2 C65.1 C66.2 C67.2(-) C68.2(-) C70.2 C71.1 C72.2 C73.1 C74.1 C75.1 C76.1 C80.2 C81.1 C82.2 D6.A J6.1(+) J6.3(+) R20.1 R25.1 R26.1 R30.1 R32.1 TP21.1 TPG1.1 TPG2.1 TPG3.1 TPG4.1 U5.3(GND) U5.6(GND) U7.2(GND) U8.4(V-) U9.4(V-) U11.4(V-) U12.2(GND) U14.2(GND) ; sheet Charge Pump/gnd
3V3_comp_sense: R27.1 TP9.1 U9.1(OUTA) ; port 3V3_comp_sense
5v_comp_sense: R31.1 TP10.1 U9.7(OUTB) ; port 5v_comp_sense
power_raw: F2.1 J6.2(+)
NetC61_1: C61.1 U5.4(NR)
NetC70_1: C70.1 L2.2 U12.1(IN)
NetD5_C: D5.C R20.2
NetR23_2: R23.2 U8.8(IN+)
NetR24_2: R24.2 U8.1(IN-)
NetR25_2: R25.2 U8.5(VOUT) U9.3(+)
NetR26_2: R26.2 R27.2 U9.2(-)
NetR28_2: R28.2 U11.8(IN+)
NetR29_2: R29.2 U11.1(IN-)
NetR30_2: R30.2 U9.5(+) U11.5(VOUT)
NetR31_2: R31.2 R32.2 U9.6(-)

Not connected (* = marked no-connect by the designer): U8 3(NC) 6(NC) 7(NC); U11 3(NC) 6(NC) 7(NC)

### Layout directives
net class Power: +1V2D, +3V3A, +3V3D, +3V3D_COMP, +5VA, +5VA_COMP, +5VD, +V_IN, -5VA
net class Ground: GND

### Notes on the sheet
- (near F2) Power Input 6V
- (near R23) RIN
- (near U8) GAIN=ROUT/RIN
- (near R25) ROUT
- Date:
- Rev:
- of
- Sheet
- (in symbol Diodes/AP7363-12D-13) +1.2V
- (in symbol Diodes/AP7363-33D-13) +3.3V
- (in symbol T491D227K016AT) +

### Library data of the parts
C57 = T491D227K016AT: CAP-TANT, 2, 220UF 16V 10% 2917; Manufacturer: KEMET; Manufacturer Size Code: D; Capacitance: 220µF; ESR (Equivalent Series Resistance): 500 mOhm; Lifetime @ Temp.: 2000 Hrs @ 85°C; Type: Molded; Supplier 1: Digi-Key; Manufacturer Part Number: T491D227K016AT; RoHS: RoHS Compliant; Category: Capacitors; Stock 1: 48724; Pricing 1: 1=1.28, 10=1.009, 25=0.9248, 50=0.8744, 100=0.7568, 250=0.67268 (USD); Packaging: Cut Tape (CT); Tolerance: ±10%; Operating Temperature: -55°C ~ 125°C; Lead Spacing: -; Size / Dimension: 0.287" L x 0.169" W (7.30mm x 4.30mm); Height - Seated (Max): 0.122" (3.10mm); Mounting Type: Surface Mount; Package / Case: 2917 (7343 Metric); ComponentLink1URL: http://www.kemet.com/Lists/ProductCatalog/Attachments/254/KEM_T2005_T491.pdf; ComponentLink1Description: http://www.kemet.com/Lists/ProductCatalog/Attachments/254/KEM_T2005_T491.pdf; Supplier Part Number 1: 399-10429-1-ND; Part Status: Active; Features: General Purpose; Failure Rate: -; Supplier 2: Digi-Key; Stock 2: 48724; Pricing 2: 1=1.28, 10=1.009, 25=0.9248, 50=0.8744, 100=0.7568, 250=0.67268 (USD); Supplier Part Number 2: 399-10429-6-ND
C59 C62 C64 C70 C73 C75 C80 = Murata/GRM188R61E105KA12D: as C2 on sheet lct_comp; Supplier 1: Digi-Key; Manufacturer Part Number: GRM188R61E105KA12D; RoHS: RoHS Compliant; Category: Capacitors; Packaging: Cut Tape (CT); Tolerance: ±10%; Voltage - Rated: 25V; Mounting Type: Surface Mount, MLCC; Operating Temperature: -55°C ~ 85°C; Package / Case: 0603 (1608 Metric); Size / Dimension: 0.063" L x 0.031" W (1.60mm x 0.80mm); Height - Seated (Max): -; Lead Spacing: -; Features: -; ComponentLink1URL: http://www.murata.com/~/media/webrenewal/support/library/catalog/products/capacitor/mlcc/c02e.pdf; ComponentLink1Description: http://www.murata.com/~/media/webrenewal/support/library/catalog/products/capacitor/mlcc/c02e.pdf; Supplier Part Number 1: 490-3897-1-ND; Stock 1: 1899119; Pricing 1: 1=0.1, 10=0.036, 50=0.0196, 100=0.0165, 250=0.01352, 500=0.01156, 1000=0.009 (USD); Applications: General Purpose; Ratings: -; Thickness (Max): 0.035" (0.90mm); Lead Style: -
C60 C67 C68 = CAP/TAJE107K016R: CAP-TANT, 2, 100uF, 10%, 16V, 2917; Manufacturer: AVX Corporation; Manufacturer Part Number: TAJE107K016RNJ; Manufacturer Size Code: E; Capacitance: 100µF; ESR (Equivalent Series Resistance): 900 mOhm; Type: Molded; Supplier 1: Digi-Key; RoHS: RoHS Compliant; Category: Capacitors; Stock 1: 186; Pricing 1: 1=1.95, 10=1.595, 100=1.1281 (USD); Packaging: Cut Tape (CT); Tolerance: ±10%; Voltage - Rated: 16V; Operating Temperature: -55°C ~ 125°C; Mounting Type: Surface Mount; Package / Case: 2917 (7343 Metric); Size / Dimension: 0.287" L x 0.169" W (7.30mm x 4.30mm); Height - Seated (Max): 0.169" (4.30mm); Lead Spacing: -; Features: General Purpose; Lifetime @ Temp.: -; ComponentLink1URL: http://datasheets.avx.com/TAJ.pdf; ComponentLink1Description: http://datasheets.avx.com/TAJ.pdf; Supplier 2: Newark; Supplier Part Number 1: 478-3945-1-ND; Supplier Part Number 2: 60R6026
C61 C63 C66 C72 C74 C76 C82 = CAP/06035C104KAT2A: as C3 on sheet lct_comp; Supplier 1: Digi-Key; Manufacturer Part Number: 06035C104KAT2A; RoHS: RoHS Compliant; Category: Capacitors; Packaging: Cut Tape (CT); Tolerance: ±10%; Voltage - Rated: 50V; Operating Temperature: -55°C ~ 125°C; Mounting Type: Surface Mount, MLCC; Package / Case: 0603 (1608 Metric); Size / Dimension: 0.063" L x 0.032" W (1.60mm x 0.81mm); Height - Seated (Max): -; Lead Spacing: -; Features: -; ComponentLink1URL: http://datasheets.avx.com/X7RDielectric.pdf; ComponentLink1Description: http://datasheets.avx.com/X7RDielectric.pdf; Supplier Part Number 1: 478-5052-1-ND; Stock 1: 4412408; Pricing 1: 1=0.1, 10=0.036, 25=0.0264, 50=0.0198, 100=0.0162, 250=0.01352, 500=0.01156, 1000=0.00908 (USD); Temperature Coefficient: X7R; Applications: General Purpose; Ratings: -; Thickness (Max): 0.035" (0.90mm); Lead Style: -; Supplier 2: Newark; Supplier Part Number 2: 54K2412
C65 C71 C81 = CAP/GMK316F106ZL-T: as C39 on sheet lct_comp; Supplier 1: Digi-Key; Manufacturer Part Number: GMK316F106ZL-T; RoHS: RoHS Compliant; Category: Capacitors; Stock 1: 249989; Pricing 1: 1=0.46, 10=0.345, 50=0.2012, 100=0.161, 250=0.115, 500=0.0782, 1000=0.06325 (USD); Packaging: Cut Tape (CT); Voltage - Rated: 35V; Mounting Type: Surface Mount, MLCC; Operating Temperature: -30°C ~ 85°C; Applications: General Purpose; Ratings: -; Package / Case: 1206 (3216 Metric); Size / Dimension: 0.126" L x 0.063" W (3.20mm x 1.60mm); Height - Seated (Max): -; Thickness (Max): 0.071" (1.80mm); Lead Spacing: -; Features: -; Lead Style: -; ComponentLink1URL: http://ds.yuden.co.jp/TYCOMPAS/ut/detail.do?productNo=GMK316F106ZL-T&fileName=GMK316F106ZL-T_SS&mode=specSheetDownload; ComponentLink1Description: http://ds.yuden.co.jp/TYCOMPAS/ut/detail.do?productNo=GMK316F106ZL-T&fileName=GMK316F106ZL-T_SS&mode=specSheetDownload; Supplier Part Number 1: 587-1352-1-ND
D5 = LITEON/LTST-C171KRKT: LED, 20mA, 0805, Red; Supplier 1: Digi-Key; Supplier Part Number 1: 160-1427-1-ND
D6 = ONSEMI/1SMB5931BT3G: Diode, Zener, 18V, 3W, SMB; Manufacturer: ON Semiconductor; Tolerance: ±5%; Impedance (Max) (Zzt): 12 Ohm; Current - Reverse Leakage @ Vr: 1µA @ 13.7V; Voltage - Forward (Vf) (Max) @ If: 1.5V @ 200mA; Supplier 1: Digi-Key; Manufacturer Part Number: 1SMB5931BT3G; RoHS: RoHS Compliant; Category: Discrete Semiconductor Products; Stock 1: 25092; Pricing 1: 1=0.47, 10=0.35, 100=0.2183, 500=0.14928, 1000=0.11474 (USD); Packaging: Cut Tape (CT); Voltage - Zener (Nom) (Vz): 18V; Power - Max: 3W; Operating Temperature: -65°C ~ 150°C; Mounting Type: Surface Mount; Package / Case: DO-214AA, SMB; Supplier Device Package: SMB; ComponentLink1URL: http://www.onsemi.com/pub_link/Collateral/1SMB5913BT3-D.PDF; ComponentLink1Description: http://www.onsemi.com/pub_link/Collateral/1SMB5913BT3-D.PDF; Supplier Part Number 1: 1SMB5931BT3GOSCT-ND; Part Status: Active; Supplier 2: Newark; Supplier Part Number 2: 45J2455
F2 = Littelfuse/1206L: FUSE, Resetable, 1206 Generic
J6 = TE/640456-3: HEADER, Friction Lock, 3x1; Manufacturer: TE Connectivity AMP Connectors; Connector Type: Header, Unshrouded; Number of Positions: 3; Number of Positions Loaded: All; Pitch: 0.100" (2.54mm); Supplier 1: Digi-Key; Manufacturer Part Number: 640456-3; RoHS: RoHS Compliant; Category: Connectors, Interconnects; Stock 1: 39841; Pricing 1: 1=0.13, 10=0.119, 100=0.095, 500=0.088, 1000=0.081, 2000=0.075, 5000=0.07, 10000=0.056, 25000=0.052 (USD); Packaging: Bulk; Contact Type: Male Pin; Number of Rows: 1; Row Spacing: -; Contact Mating Length: 0.295" (7.49mm); Mounting Type: Through Hole; Termination: Solder; Fastening Type: Friction Lock; Features: -; Contact Finish: Tin; Contact Finish Thickness: -; Color: Natural; ComponentLink1URL: http://www.te.com/commerce/DocumentDelivery/DDEController?Action=srchrtrv&DocNm=640456&DocType=Customer+Drawing&DocLang=English; ComponentLink1Description: http://www.te.com/commerce/DocumentDelivery/DDEController?Action=srchrtrv&DocNm=640456&DocType=Customer+Drawing&DocLang=English; Supplier Part Number 1: A19470-ND
L2 = MURATA 83223C: IND, 22uH, 500mA; Supplier 1: Newark; Supplier Part Number 1: 59T0308
R20 R26 R32 = CRCW06031K00FKEA: RES1, SMD, 1.00k, 1.0%, 1/10W, 0603; Manufacturer: Vishay Dale; Tolerance: ±1%; Power (Watts): 0.1W, 1/10W; Temperature Coefficient: ±100ppm/°C; Supplier 1: Digi-Key; Manufacturer Part Number: CRCW06031K00FKEA; RoHS: RoHS Compliant; Category: Resistors; Stock 1: 770011; Pricing 1: 1=0.1, 10=0.03, 25=0.022, 50=0.0168, 100=0.0123, 250=0.0094, 500=0.00752, 1000=0.00554, 2500=0.00481 (USD); Packaging: Cut Tape (CT); Resistance (Ohms): 1k; Composition: Thick Film; Features: Automotive AEC-Q200; Operating Temperature: -55°C ~ 155°C; Package / Case: 0603 (1608 Metric); Supplier Device Package: 0603; Size / Dimension: 0.061" L x 0.033" W (1.55mm x 0.85mm); Height: 0.020" (0.50mm); Number of Terminations: 2; ComponentLink1URL: http://www.vishay.com/docs/20035/dcrcwe3.pdf; ComponentLink1Description: http://www.vishay.com/docs/20035/dcrcwe3.pdf; Supplier 2: Newark; Supplier Part Number 1: 541-1.00KHCT-ND; Supplier Part Number 2: 52K8015
R21 R22 = RES SMD 0.01 OHM 1% 1W 1206: RES0, SMD, 0.01Z, 1.0%, 1/4W,  1206; Manufacturer: Panasonic Electronic Components; Manufacturer Part Number: ERJ-8BWFR010V; Resistance (Ohms): 0.01; Tolerance: ±1%; Power (Watts): 1W; Temperature Coefficient: ±200ppm/°C; Supplier 1: Digi-Key; RoHS: RoHS Compliant; Category: Resistors; Stock 1: 27187; Pricing 1: 1=0.72, 50=0.464, 100=0.4038, 250=0.36084, 500=0.2921, 1000=0.23625 (USD); Packaging: Cut Tape (CT); Part Status: Active; Composition: Thick Film; Features: Automotive AEC-Q200, Current Sense; Operating Temperature: -55°C ~ 155°C; Package / Case: 1206 (3216 Metric); Supplier Device Package: 1206; Size / Dimension: 0.126" L x 0.063" W (3.20mm x 1.60mm); Height - Seated (Max): 0.030" (0.75mm); Number of Terminations: 2; Failure Rate: -; ComponentLink1URL: https://industrial.panasonic.com/cdbs/www-data/pdf/RDA0000/AOA0000C239.pdf; ComponentLink1Description: https://industrial.panasonic.com/cdbs/www-data/pdf/RDA0000/AOA0000C239.pdf; Supplier Part Number 1: P.010AUCT-ND
R23 R24 R28 R29 = CRCW0603110RFKEA: RES0, SMD,  100Z, 1.0%, 1/10W, 0603; Manufacturer: Panasonic Electronic Components; Manufacturer Part Number: ERJ-3EKF1000V; Resistance (Ohms): 100; Tolerance: ±1%; Power (Watts): 0.1W, 1/10W; Temperature Coefficient: ±100ppm/°C; RoHS: RoHS Compliant; Category: Resistors; Packaging: Cut Tape (CT); Composition: Thick Film; Features: Automotive AEC-Q200; Operating Temperature: -55°C ~ 155°C; Package / Case: 0603 (1608 Metric); Supplier Device Package: 0603; Size / Dimension: 0.063" L x 0.031" W (1.60mm x 0.80mm); Height: 0.022" (0.55mm); Number of Terminations: 2; ComponentLink1URL: http://industrial.panasonic.com/www-cgi/jvcr13pz.cgi?E+PZ+3+AOA0002+ERJ3EKF1000V+7+WW; ComponentLink1Description: http://industrial.panasonic.com/www-cgi/jvcr13pz.cgi?E+PZ+3+AOA0002+ERJ3EKF1000V+7+WW; Supplier 1: Digi-Key; Stock 1: 1259466; Pricing 1: 1=0.1, 50=0.015, 100=0.0114, 250=0.00844, 500=0.00624, 1000=0.00416, 2500=0.00351 (USD); Supplier Part Number 1: P100HCT-ND
R25 R27 R30 R31 = CRCW060310K0FKEA: as R11 on sheet lct_comp; Supplier 1: Digi-Key; Manufacturer Part Number: CRCW060310K0FKEA; RoHS: RoHS Compliant; Category: Resistors; Stock 1: 1592879; Pricing 1: 1=0.1, 10=0.03, 25=0.022, 50=0.0168, 100=0.0123, 250=0.0094, 500=0.00752, 1000=0.00554, 2500=0.00481 (USD); Packaging: Cut Tape (CT); Resistance (Ohms): 10k; Composition: Thick Film; Features: Automotive AEC-Q200; Operating Temperature: -55°C ~ 155°C; Package / Case: 0603 (1608 Metric); Supplier Device Package: 0603; Size / Dimension: 0.061" L x 0.033" W (1.55mm x 0.85mm); Height: 0.020" (0.50mm); Number of Terminations: 2; ComponentLink1URL: http://www.vishay.com/docs/20035/dcrcwe3.pdf; ComponentLink1Description: http://www.vishay.com/docs/20035/dcrcwe3.pdf; Supplier Part Number 1: 541-10.0KHCT-ND
TP9-TP13 TP15-TP21 = TP_MICRO: Test Point, Round, Small
TPG1-TPG4 = TPG: Test Point, GND, Through Hole
U5 = TI/REG104 5V0 SOT223-6: LDO, 5.0V Fixed, 1A, DMOS; Manufacturer: Texas Instruments; Manufacturer Part Number: REG104GA-5/2K5; Regulator Topology: Positive Fixed; Voltage - Output: 5V; Voltage - Dropout (Typical): 0.32V @ 1A; Number of Regulators: 1; Voltage - Input: Up to 15V; Current - Limit (Min): 1.2A; Supplier 1: Digi-Key; RoHS: RoHS Compliant; Category: Integrated Circuits (ICs); Stock 1: 30; Pricing 1: 1=5.41, 10=4.851, 100=3.9798, 500=3.3858, 1000=2.8512 (USD); Packaging: Cut Tape (CT); Current - Output: 1A; Operating Temperature: -40°C ~ 85°C; Mounting Type: Surface Mount; Package / Case: SOT-223-6; Supplier Device Package: SOT-223-6; ComponentLink1URL: http://www.ti.com/lit/ds/symlink/reg104.pdf; ComponentLink1Description: http://www.ti.com/lit/ds/symlink/reg104.pdf; Supplier Part Number 1: REG104GA-5CT-ND
U7 U12 = Diodes/AP7363-33D-13: LDO, 3.3V, 1.5A, 190mV Dropout, Ceramic Stable, +5.5VMAX Input; Supplier 1: Digi-Key; Supplier Part Number 1: AP7363-33D-13CT-ND
U8 U11 = LT/LT6105CMS8#PBF: OPA, Current Sense, 100 kHz, Extended Input Range; Manufacturer: Linear Technology; Number of Circuits: 1; Slew Rate: 2 V/µs; -3db Bandwidth: 100kHz; Voltage - Input Offset: 100µV; Current - Supply: 240µA; Current - Output / Channel: 1mA; Voltage - Supply, Single/Dual (±): 2.85 V ~ 36 V, ±1.425 V ~ 18 V; Supplier 1: Digi-Key; Manufacturer Part Number: LT6105CMS8#PBF; RoHS: RoHS Compliant; Category: Integrated Circuits (ICs); Stock 1: 2594; Pricing 1: 1=2.11, 25=1.4012, 100=1.15 (USD); Packaging: Tube; Amplifier Type: Current Sense; Output Type: -; Gain Bandwidth Product: -; Current - Input Bias: -; Operating Temperature: 0°C ~ 70°C; Mounting Type: Surface Mount; Package / Case: 8-TSSOP, 8-MSOP (0.118", 3.00mm Width); Supplier Device Package: 8-MSOP; ComponentLink1URL: http://www.linear.com/docs/25764; ComponentLink1Description: http://www.linear.com/docs/25764; Supplier 2: Newark; Supplier Part Number 1: LT6105CMS8#PBF-ND; Supplier Part Number 2: 75M4760
U9 = TI/LM6152 SOIC-8: OPA- 75MHz, Dual, RRIO, Single-supply; Manufacturer: Texas Instruments; Manufacturer Part Number: LM6152BCMX/NOPB; Amplifier Type: General Purpose; Number of Circuits: 2; Output Type: Rail-to-Rail; Slew Rate: 30 V/µs; Gain Bandwidth Product: 80MHz; Current - Input Bias: 500nA; Voltage - Input Offset: 300µV; Current - Supply: 1.6mA; Current - Output / Channel: 16.9mA; Voltage - Supply, Single/Dual (±): 2.7 V ~ 24 V, ±1.35 V ~ 12 V; Supplier 1: Digi-Key; RoHS: RoHS Compliant; Category: Integrated Circuits (ICs); Stock 1: 6943; Pricing 1: 1=3.66, 10=3.285, 100=2.6954, 500=2.29312, 1000=1.67625 (USD); Packaging: Cut Tape (CT); Part Status: Active; -3db Bandwidth: -; Operating Temperature: 0°C ~ 70°C; Mounting Type: Surface Mount; Package / Case: 8-SOIC (0.154", 3.90mm Width); Supplier Device Package: 8-SOIC; ComponentLink1URL: http://www.ti.com/lit/ds/symlink/lm6152.pdf; ComponentLink1Description: http://www.ti.com/lit/ds/symlink/lm6152.pdf; Supplier Part Number 1: 296-35423-1-ND
U14 = Diodes/AP7363-12D-13: LDO, 1.2V, 1.5A, 190mV Dropout, Ceramic Stable, +5.5VMAX Input; Manufacturer: Diodes Incorporated; Regulator Topology: Positive Fixed; Number of Regulators: 1; Voltage - Input: 2.2 V ~ 5.5 V; Supplier 1: Digi-Key; Manufacturer Part Number: AP7363-12D-13; RoHS: RoHS Compliant; Category: Integrated Circuits (ICs); Stock 1: 5601; Pricing 1: 1=0.56, 10=0.484, 100=0.3613, 500=0.28376, 1000=0.21875 (USD); Packaging: Cut Tape (CT); Voltage - Output: 1.2V; Current - Output: 1.5A; Voltage - Dropout (Typical): -; Current - Limit (Min): -; Operating Temperature: -40°C ~ 85°C; Mounting Type: Surface Mount; Package / Case: TO-252-3, DPak (2 Leads + Tab), SC-63; Supplier Device Package: TO-252-3; ComponentLink1URL: http://www.diodes.com/_files/datasheets/AP7363.pdf; ComponentLink1Description: http://www.diodes.com/_files/datasheets/AP7363.pdf; Supplier Part Number 1: AP7363-12D-13CT-ND; Part Status: Active